# EAGLE design Amiga USB Serial Adapter (EAGLE 7.6.0)
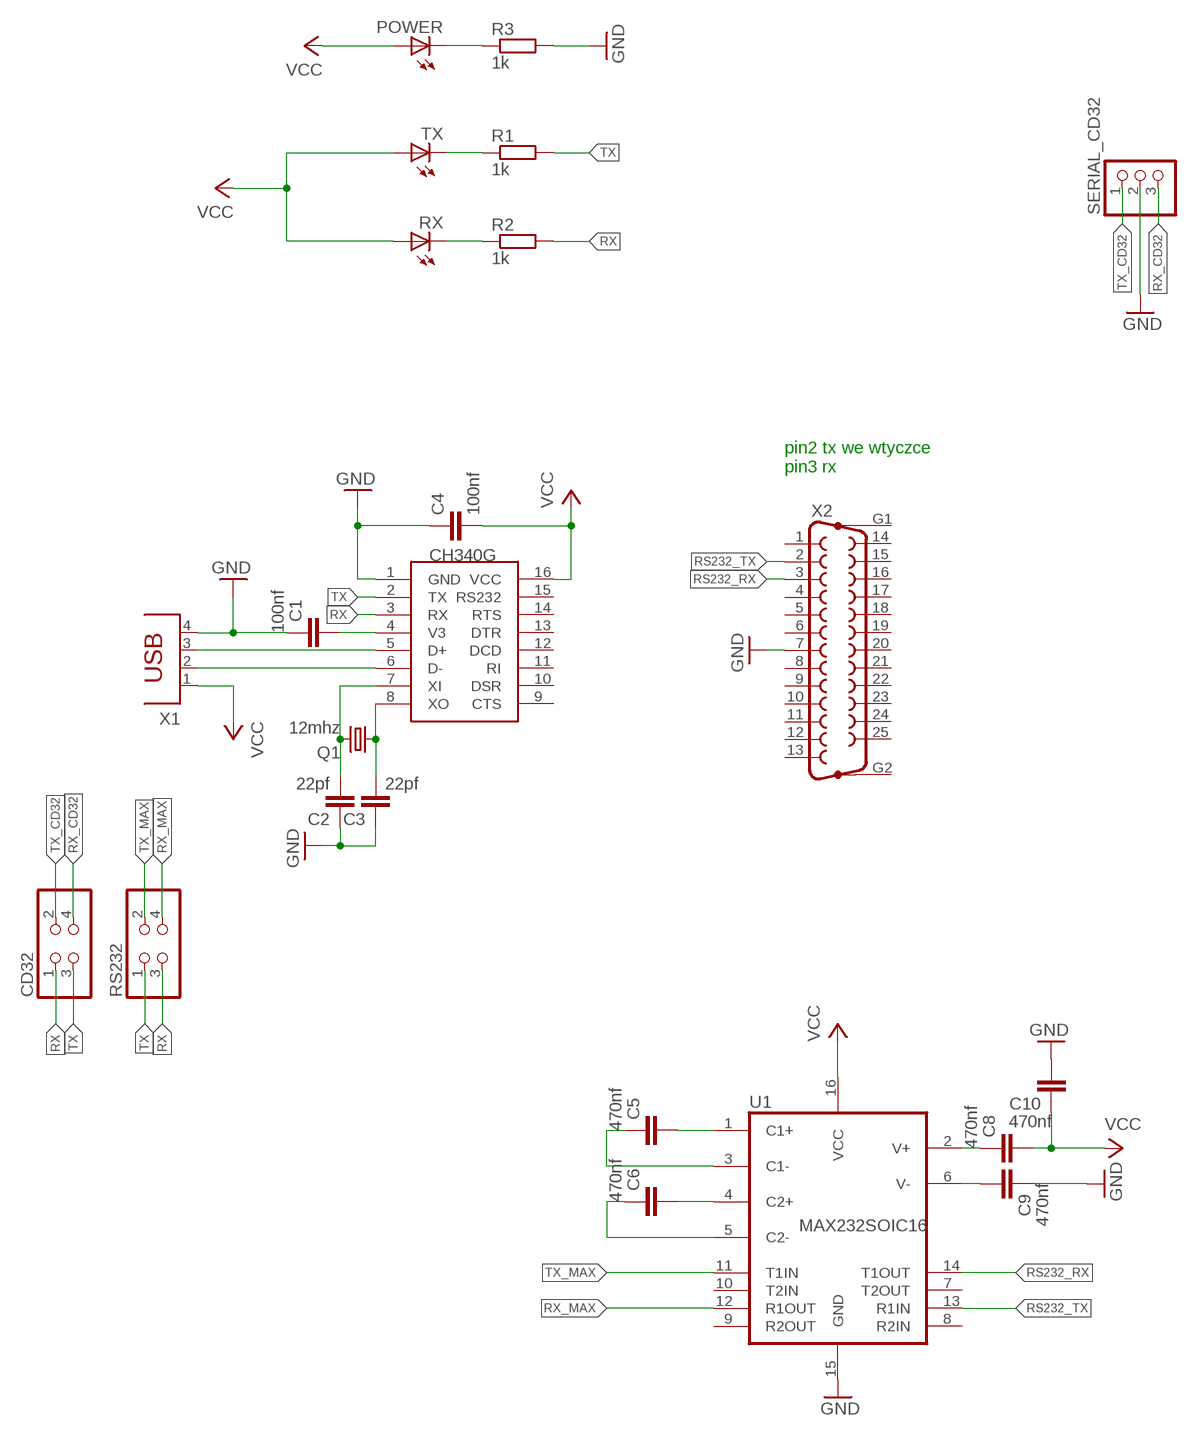
[diagram p0: schematic, sheet 1]

## Parts
C1  100nf  C-EUC0805  [C0805]
C2  22pf  C-EUC0805  [C0805]
C3  22pf  C-EUC0805  [C0805]
C4  100nf  C-EUC0805  [C0805]
C5  470nf  C-EUC0805  [C0805]
C6  470nf  C-EUC0805  [C0805]
C8  470nf  C-EUC0805  [C0805]
C9  470nf  C-EUC0805  [C0805]
C10  470nf  C-EUC0805  [C0805]
CD32  PINHD-2X2  [2X02]
POWER  LEDCHIPLED_0805  [CHIPLED_0805]
Q1  12mhz  CRYSTALHC49U-V  [HC49U-V]
R1  1k  R-EU_R0805  [R0805]
R2  1k  R-EU_R0805  [R0805]
R3  1k  R-EU_R0805  [R0805]
RS232  PINHD-2X2  [2X02]
RX  LEDCHIPLED_0805  [CHIPLED_0805]
SERIAL_CD32  PINHD-1X3  [1X03]
TX  LEDCHIPLED_0805  [CHIPLED_0805]
U1  MAX232SOIC16  [SO016]
U$1  CH340G  [SOIC16]
X1  PN61729  [PN61729]
X2  F25HP  [F25HP]

## Nets
GND: C1.1 C2.1 C3.1 C4.1 C9.1 C10.2 R3.2 SERIAL_CD32.2 U1.15(GND) U$1.1(GND) X1.4 X2.7
N$1: U$1.6(D-) X1.2
N$2: U$1.5(D+) X1.3
N$3: C2.2 Q1.2 U$1.7(XI)
N$4: C1.2 U$1.4(V3)
N$5: C3.2 Q1.1 U$1.8(XO)
N$6: C5.1 U1.3(C1-)
N$7: C5.2 U1.1(C1+)
N$8: C6.2 U1.4(C2+)
N$9: C6.1 U1.5(C2-)
N$10: C8.1 U1.2(V+)
N$11: C9.2 U1.6(V-)
N$12: R1.1 TX.C
N$13: R2.1 RX.C
N$14: POWER.C R3.1
RS232_RX: U1.14(T1OUT) X2.3
RS232_TX: U1.13(R1IN) X2.2
RX: CD32.1 R2.2 RS232.3 U$1.3(RX)
RX_CD32: CD32.4 SERIAL_CD32.3
RX_MAX: RS232.4 U1.12(R1OUT)
TX: CD32.3 R1.2 RS232.1 U$1.2(TX)
TX_CD32: CD32.2 SERIAL_CD32.1
TX_MAX: RS232.2 U1.11(T1IN)
VCC: C4.2 C8.2 C10.1 POWER.A RX.A TX.A U1.16(VCC) U$1.16(VCC) X1.1
Unconnected: U1.7(T2OUT) U1.8(R2IN) U1.9(R2OUT) U1.10(T2IN) U$1.9(CTS) U$1.10(DSR) U$1.11(RI) U$1.12(DCD) U$1.13(DTR) U$1.14(RTS) U$1.15(RS232) X2.1 X2.4 X2.5 X2.6 X2.8 X2.9 X2.10 X2.11 X2.12 X2.13 X2.14 X2.15 X2.16 X2.17 X2.18 X2.19 X2.20 X2.21 X2.22 X2.23 X2.24 X2.25 X2.G1 X2.G2

## Notes on the sheet
- pin2 tx we wtyczce
  pin3 rx

## Library data of the parts
C1-C6 C8-C10 = rcl:C-EU: CAPACITOR, European symbol
CD32 RS232 = pinhead:PINHD-2X2: PIN HEADER
POWER RX TX = led:LED: LED OSRAM: - CHIPLED LG R971, LG N971, LY N971, LG Q971, LY Q971, LO R971, LY R971 LH N974, LH R974 LS Q976, LO Q976, LY Q976 LO Q996 - Hyper CHIPLED LW Q18S LB Q993, LB Q99A, LB R99A - SideLED LS A670, LO A670, LY A670, LG A670, LP A670 LB A673, LV A673, LT A673, LW A673 LH A674 LY A675 LS A676, LA A676, LO A676, LY A676, LW A676 LS A679, LY A679, LG A679 - Hyper Micro SIDELED® LS Y876, LA Y876, LO Y876, LY Y876 LT Y87S - SmartLED LW L88C, LW L88S LB L89C, LB L89S, LG L890 LS L89K, LO L89K, LY L89K LS L896, LA L896, LO L896, LY L896 - TOPLED LS T670, LO T670, LY T670, LG T670, LP T670 LSG T670, LSP T670, LSY T670, LOP T670, LYG T670 LG T671, LOG T671, LSG T671 LB T673, LV T673, LT T673, LW T673 LH T674 LS T676, LA T676, LO T676, LY T676, LB T676, LH T676, LSB T676, LW T676 LB T67C, LV T67C, LT T67C, LS T67K, LO T67K, LY T67K, LW E67C LS E67B, LA E67B, LO E67B, LY E67B, LB E67C, LV E67C, LT E67C LW T67C LS T679, LY T679, LG T679 LS T770, LO T770, LY T770, LG T770, LP T770 LB T773, LV T773, LT T773, LW T773 LH T774 LS E675, LA E675, LY E675, LS T675 LS T776, LA T776, LO T776, LY T776, LB T776 LHGB T686 LT T68C, LB T68C - Hyper Mini TOPLED® LB M676 - Mini TOPLED Santana® LG M470 LS M47K, LO M47K, LY M47K Source: http://www.osram.convergy.de LUXEON: - LUMILED® LXK2-PW12-R00, LXK2-PW12-S00, LXK2-PW14-U00, LXK2-PW14-V00 LXK2-PM12-R00, LXK2-PM12-S00, LXK2-PM14-U00 LXK2-PE12-Q00, LXK2-PE12-R00, LXK2-PE12-S00, LXK2-PE14-T00, LXK2-PE14-U00 LXK2-PB12-K00, LXK2-PB12-L00, LXK2-PB12-M00, LXK2-PB14-N00, LXK2-PB14-P00, LXK2-PB14-Q00 LXK2-PR12-L00, LXK2-PR12-M00, LXK2-PR14-Q00, LXK2-PR14-R00 LXK2-PD12-Q00, LXK2-PD12-R00, LXK2-PD12-S00 LXK2-PH12-R00, LXK2-PH12-S00 LXK2-PL12-P00, LXK2-PL12-Q00, LXK2-PL12-R00 Source: www.luxeon.com KINGBRIGHT: KA-3528ASYC Source: www.kingbright.com
Q1 = crystal:CRYSTAL: CRYSTAL; OC_FARNELL: 1666969; OC_NEWARK: unknown
R1-R3 = rcl:R-EU_: RESISTOR, European symbol
SERIAL_CD32 = pinhead:PINHD-1X3: PIN HEADER
U1 = MAXIM:MAX232: RS232 Transceiver Very common IC. This is generically called 'MAX232', but works with the 3V equivalent MAX3232 generic ICs. Field tested and mother approved. Spark Fun Electronics SKU : COM-00316 (DIP) and COM-00589 (SMD)
U$1 = ch340g:CH340G
X1 = con-berg:PN61729: BERG USB connector; OC_FARNELL: unknown; OC_NEWARK: unknown
X2 = con-subd:F25HP: SUB-D; OC_FARNELL: unknown; OC_NEWARK: unknown

## Board
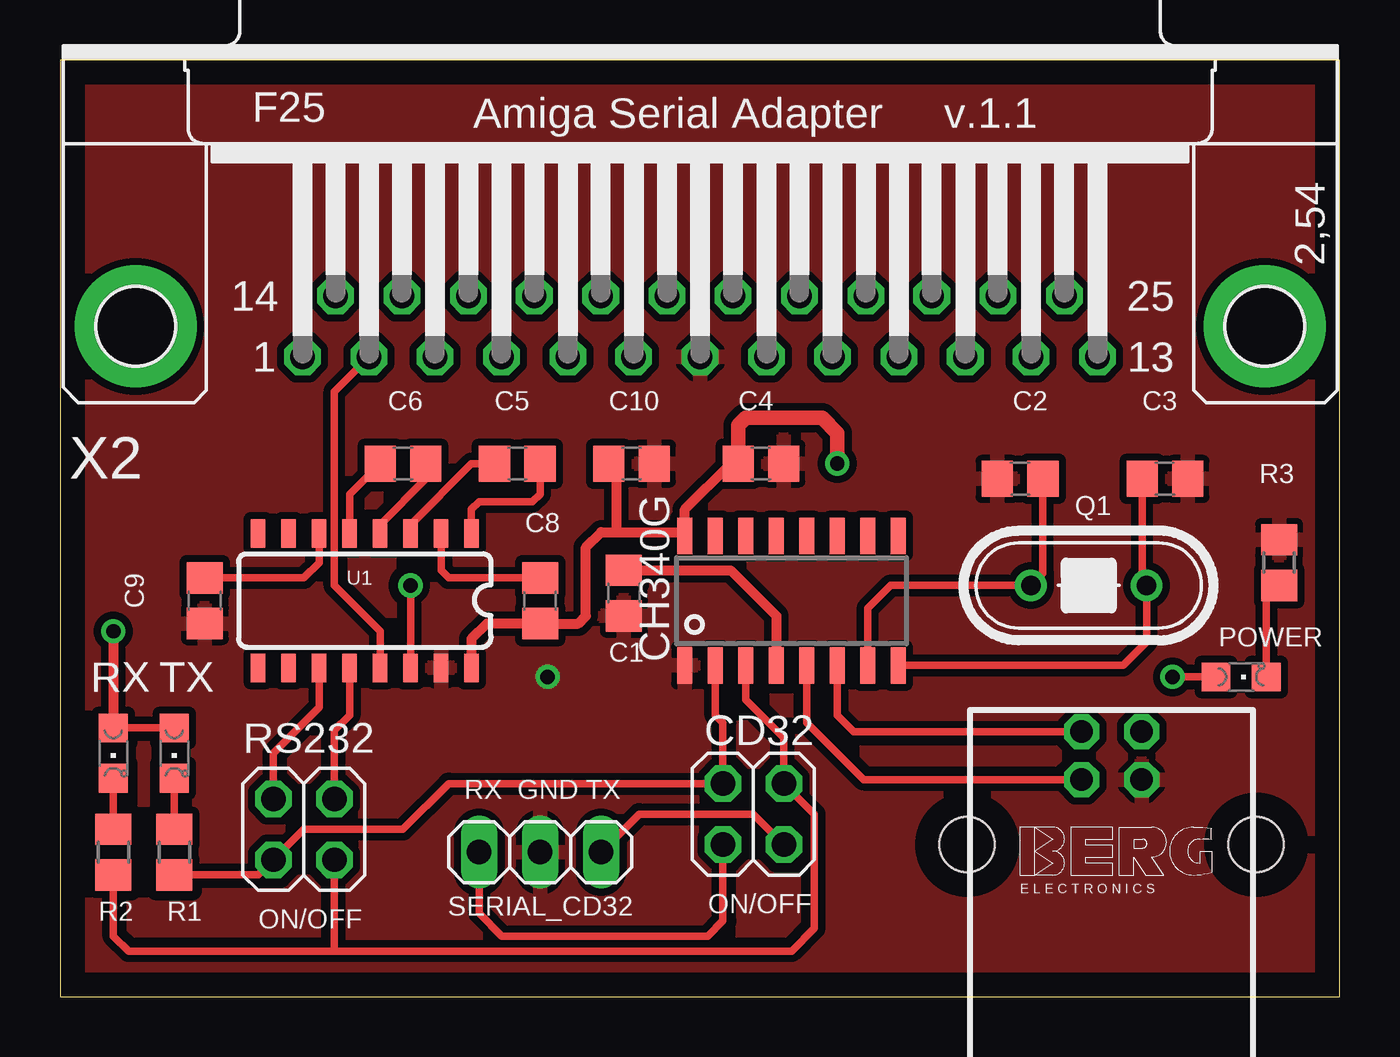
[diagram p1: board, top side]
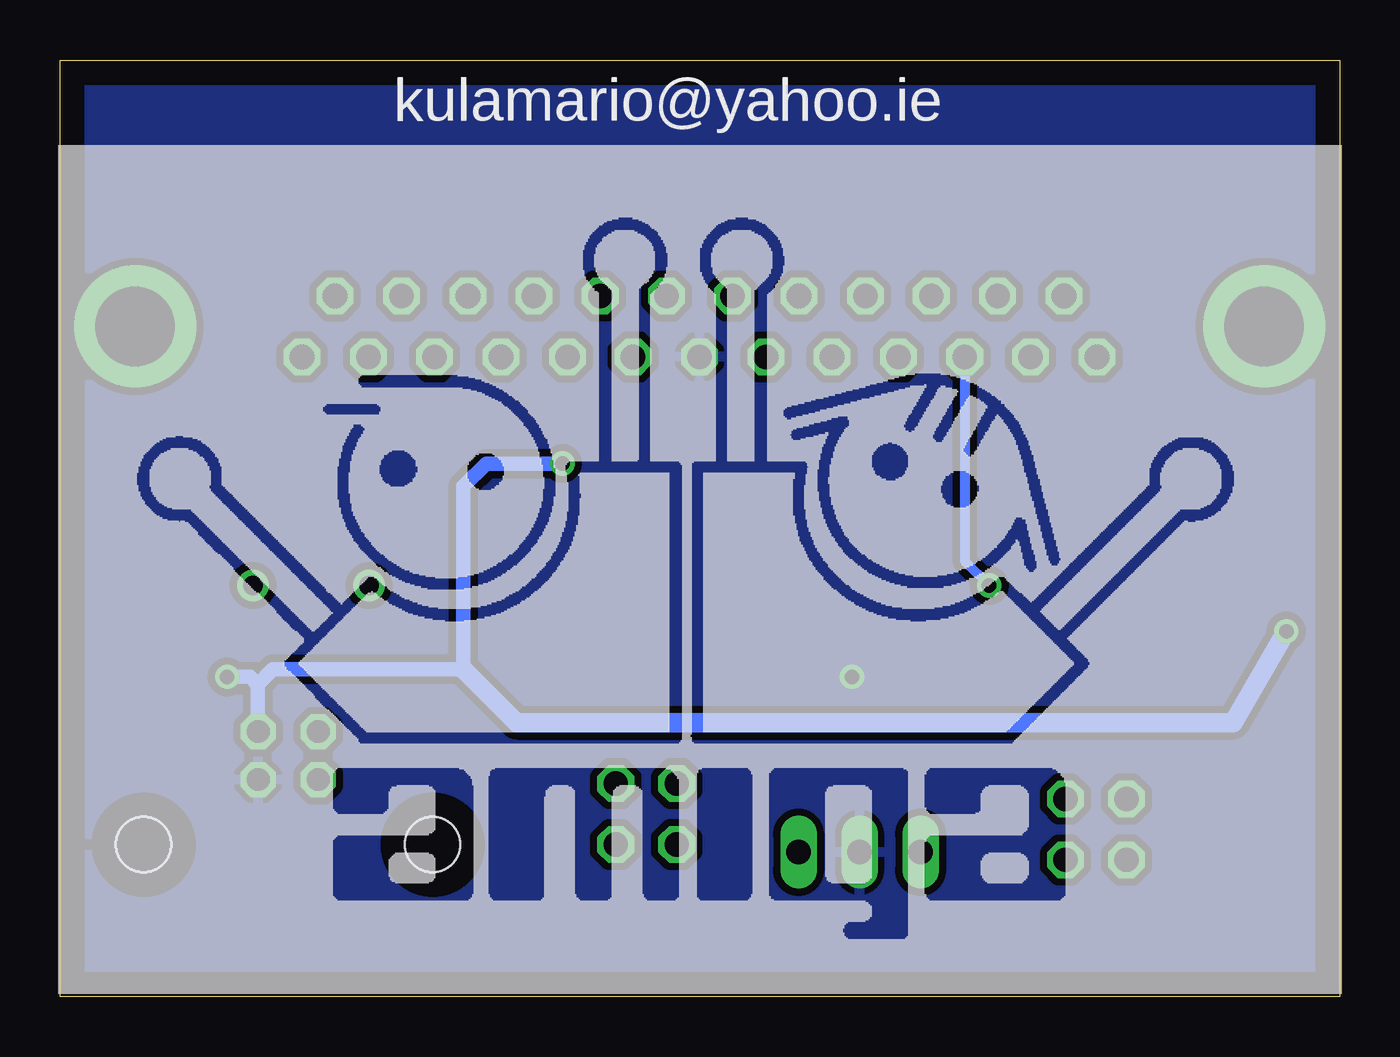
[diagram p2: board, bottom side, seen from below]

Size 53.32 x 39.04 mm. Coordinates in mm from the lower left corner, seen from the top.
Outline: 0,0 53.32,0 53.32,39.04 0,39.04 0,0
Copper layers (1*16): Top 0.035mm / dielectric 1.5mm / Bottom 0.035mm
Design rules "default": minimum track width 10mil, minimum drill 24mil, track to track 8mil, track to pad 8mil, pad to pad 8mil, via to via 8mil, smd to smd 8mil, copper to edge 40mil, drill to drill 8mil, minimum pad ring 10mil, minimum via ring 8mil, stop-mask expansion 4mil, vias tented up to drill 0mil, thermal gap 10mil

### Footprints (pad centres in the part's own frame; a part is rotated, then mirrored left to right if it is on the bottom)
C0805 = smd 1.3 x 1.5: 1 -0.95,0; 2 0.95,0
2X02 = drill 1.016 octagon: 1 -1.27,-1.27; 2 -1.27,1.27; 3 1.27,-1.27; 4 1.27,1.27
CHIPLED_0805 = smd 1.2 x 1.2: A 0,-1.05; C 0,1.05
HC49U-V = drill 0.813: 1 -2.413,0; 2 2.413,0
R0805 = smd 1.3 x 1.5: 1 -0.95,0; 2 0.95,0
1X03 = drill 1.016 long: 1 -2.54,0; 2 0,0; 3 2.54,0
SO016 = smd 0.6 x 1.2: 1 -4.445,-2.8; 2 -3.175,-2.8; 3 -1.905,-2.8; 4 -0.635,-2.8; 5 0.635,-2.8; 6 1.905,-2.8; 7 3.175,-2.8; 8 4.445,-2.8; 9 4.445,2.8; 10 3.175,2.8; 11 1.905,2.8; 12 0.635,2.8; 13 -0.635,2.8; 14 -1.905,2.8; 15 -3.175,2.8; 16 -4.445,2.8
SOIC16 = smd 0.635 x 1.524: 1 -4.445,-2.695; 2 -3.175,-2.695; 3 -1.905,-2.695; 4 -0.635,-2.695; 5 0.635,-2.695; 6 1.905,-2.695; 7 3.175,-2.695; 8 4.445,-2.695; 9 4.445,2.695; 10 3.175,2.695; 11 1.905,2.695; 12 0.635,2.695; 13 -0.635,2.695; 14 -1.905,2.695; 15 -3.175,2.695; 16 -4.445,2.695
PN61729 = drill 0.95 octagon: 1 1.25,4.71; 2 -1.25,4.71; 3 -1.25,2.71; 4 1.25,2.71 | hole 2.3: -6.02,0; 6.02,0
F25HP = drill 1.016 octagon: 1 -16.561,-1.27; 2 -13.792,-1.27; 3 -11.049,-1.27; 4 -8.28,-1.27; 5 -5.512,-1.27; 6 -2.769,-1.27; 7 0,-1.27; 8 2.769,-1.27; 9 5.512,-1.27; 10 8.28,-1.27; 11 11.049,-1.27; 12 13.792,-1.27; 13 16.561,-1.27; 14 -15.189,1.27; 15 -12.421,1.27; 16 -9.652,1.27; 17 -6.909,1.27; 18 -4.14,1.27; 19 -1.372,1.27; 20 1.372,1.27; 21 4.14,1.27; 22 6.909,1.27; 23 9.652,1.27; 24 12.421,1.27; 25 15.189,1.27 | drill 3.302 pad 5.08: G1 -23.52,0; G2 23.52,0

### Placement (x,y rotation side)
C1  23.5,16.83 90 top
C2  40.01,21.59 0 top
C3  46.04,21.59 180 top
C4  29.21,22.23 180 top
C5  19.05,22.23 0 top
C6  14.29,22.23 0 top
C8  20,16.51 270 top
C9  6.03,16.51 90 top
C10  23.81,22.23 0 top
CD32  28.89,7.62 180 top
POWER  49.21,13.33 270 top
Q1  42.86,17.14 180 top
R1  4.76,6.03 270 top
R2  2.22,6.03 270 top
R3  50.8,18.1 90 top
RS232  10.16,6.98 0 top
RX  2.22,10.16 180 top
SERIAL_CD32  20,6.03 180 top
TX  4.76,10.16 180 top
U1  12.7,16.51 180 top
U$1  30.48,16.51 0 top
X1  43.82,6.35 0 top
X2  26.67,27.94 0 top

### Tracks (layer width: path | path; a pad name or v marks a point on that pad's centre or on a via)
GND  (via drill 0.6)
  other vias: 20.32,13.33
  pour Bottom (isolate 0.406): 0,39.37 53.34,39.37 53.34,0 0,0
  pour Top (isolate 0.406): 0,39.37 53.34,39.37 53.34,0 0,0
  pour Top (isolate 0.305): 0.32,39.05 53.34,39.05 53.34,0 0.32,0
  pour Bottom (isolate 0.305): 0.32,39.05 53.34,39.05 53.34,0 0.32,0
N$1
  Top 0.305: U$1.6 32.38,11.75 33.07,11.06 X1.2
N$2
  Top 0.305: U$1.5 31.11,11.43 33.48,9.06 X1.3
N$3
  Top 0.305: U$1.7 33.65,16.19 34.61,17.15 Q1.2 40.95,17.65 C2.2
N$4
  Top 0.406: C1.2 27.94,17.78 29.84,15.88 U$1.4
N$5
  Top 0.305: U$1.8 44.29,13.82 45.28,14.8 Q1.1 45.09,17.33 C3.2
N$6
  Top 0.305: U1.3 14.6,19.69 17.14,22.23 C5.1
N$7
  Top 0.305: U1.1 17.14,20.32 17.46,20.64 19.68,20.64 20,20.95 C5.2
N$8
  Top 0.305: U1.4 13.33,19.69 15.24,21.59 C6.2
N$9
  Top 0.305: U1.5 12.06,20.95 C6.1
N$10
  Top 0.305: U1.2 15.87,17.78 16.19,17.46 C8.1
  Top 0.406: 20.32,17.46 C8.1
N$11
  Top 0.305: C9.2 10.16,17.46 10.79,18.1 U1.6
N$12
  Top 0.305: R1.1 TX.C
N$13
  Top 0.305: R2.1 RX.C
N$14
  Top 0.305: R3.1 arc90 50.26,16.61 POWER.C
RS232_RX  (via drill 0.6)
  Top 0.305: U1.14 v14.6,17.15
  Bottom 0.406: X2.3 15.62,18.16 v14.6,17.15
RS232_TX
  Top 0.305: U1.13 13.33,15.24 11.43,17.15 11.43,25.22 X2.2
RX
  Top 0.305: U$1.3 28.57,12.38 30.16,10.8 CD32.1 31.43,7.62 31.43,2.86 30.48,1.91 11.43,1.91 | 11.43,1.91 2.86,1.91 2.22,2.54 R2.2 | RS232.3 11.43,1.91
RX_CD32
  Top 0.305: SERIAL_CD32.3 17.46,3.49 18.41,2.54 26.99,2.54 27.62,3.18 CD32.4
RX_MAX
  Top 0.305: U1.12 12.06,11.75 11.43,11.11 RS232.4
TX
  Top 0.305: R1.2 8.26,5.08 RS232.1 10.16,6.99 14.29,6.99 16.19,8.89 CD32.3 27.62,11.43 27.3,11.75 U$1.2
TX_CD32
  Top 0.305: SERIAL_CD32.1 24.13,7.62 28.89,7.62 CD32.2
TX_MAX
  Top 0.305: U1.11 10.79,12.07 8.89,10.16 RS232.2
VCC  (via drill 0.6)
  Top 0.305: TX.A RX.A | v46.35,13.34 POWER.A
  Top 0.406: 23.18,19.37 22.54,19.37 21.91,18.73 21.91,15.88 21.59,15.56 C8.2 17.78,15.56 17.14,14.92 U1.16 | 23.18,19.37 25.87,19.37 U$1.16 26.03,20.32 27.94,22.23 C4.2 | v2.22,15.24 RX.A | C10.1 23.18,21.91 23.18,19.37
  Top 0.61: v32.38,22.23 32.38,23.5 31.75,24.13 28.57,24.13 28.26,23.81 C4.2
  Bottom 0.61: X1.1 45.08,11.08 45.08,13.02 | 45.08,13.02 44.45,13.65 36.51,13.65 36.51,21.27 35.56,22.23 v32.38,22.23 | v46.35,13.34 45.4,13.34 45.08,13.02
  Bottom 0.813: 36.51,13.65 34.29,11.43 4.44,11.43 v2.22,15.24

### Text on the board
tNames: Amiga Serial Adapter | v.1.1 | RX | GND | TX | ON/OFF | ON/OFF
bNames: kulamario@yahoo.ie